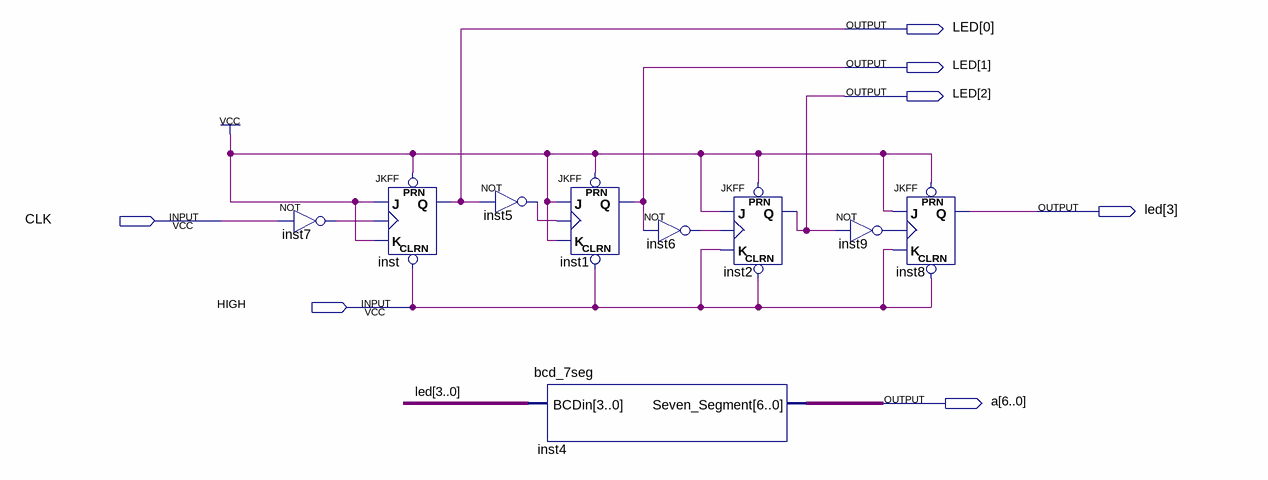
[diagram p0: schematic sheet]
// Quartus schematic COUNTER_3.bdf as structural Verilog: 9 symbols, 7 pins
module COUNTER_3 (
  input  CLK,
  input  HIGH,
  output [3:0] LED,
  output [6:0] a
);

  wire inst5_out, inst6_out, inst7_out, inst9_out;

  not inst7 (inst7_out, CLK);
  JKFF inst (.PRN(1'b1), .CLRN(HIGH), .K(1'b1), .J(1'b1), .CLK(inst7_out), .Q(LED[0]));
  not inst5 (inst5_out, LED[0]);
  bcd_7seg inst4 (.BCDin(LED), .Seven_Segment(a));
  JKFF inst1 (.PRN(1'b1), .CLRN(HIGH), .K(1'b1), .J(1'b1), .CLK(inst5_out), .Q(LED[1]));
  not inst6 (inst6_out, LED[1]);
  JKFF inst2 (.PRN(1'b1), .CLRN(HIGH), .K(HIGH), .J(1'b1), .CLK(inst6_out), .Q(LED[2]));
  not inst9 (inst9_out, LED[2]);
  JKFF inst8 (.PRN(1'b1), .CLRN(HIGH), .K(HIGH), .J(1'b1), .CLK(inst9_out), .Q(LED[3]));
endmodule
